# EAGLE design breakout (EAGLE 7.6.0)
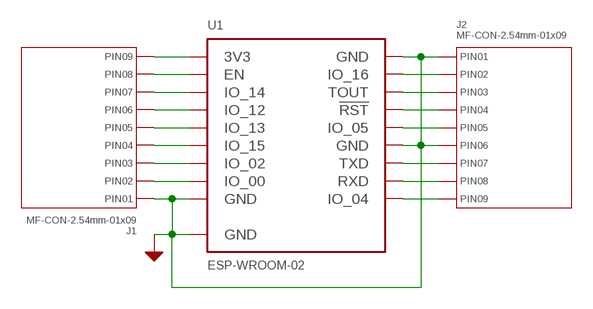
[diagram p0: schematic, sheet 1]

## Parts
J1  MF-CON-2.54mm-01x09  CON_01X09_PTH_2.54MM  [PTH_2.54MM_01X09]
J2  MF-CON-2.54mm-01x09  CON_01X09_PTH_2.54MM  [PTH_2.54MM_01X09]
U1  ESP-WROOM-02  [ESP-WROOM-02]

## Nets
GND: J1.P$1(PIN1) J2.P$1(PIN1) J2.P$6(PIN6) U1.GND U1.GND@9(GND) U1.GND@13(GND) U1.GND@18(GND)
N$1: J1.P$9(PIN9) U1.3V3
N$2: J1.P$8(PIN8) U1.EN
N$3: J1.P$7(PIN7) U1.IO_14
N$4: J1.P$6(PIN6) U1.IO_12
N$5: J1.P$5(PIN5) U1.IO_13
N$6: J1.P$4(PIN4) U1.IO_15
N$7: J1.P$3(PIN3) U1.IO_02
N$8: J1.P$2(PIN2) U1.IO_00
N$11: J2.P$2(PIN2) U1.IO_16
N$12: J2.P$3(PIN3) U1.TOUT
N$13: J2.P$4(PIN4) U1.RST(!RST)
N$14: J2.P$5(PIN5) U1.IO_05
N$16: J2.P$7(PIN7) U1.TXD
N$17: J2.P$8(PIN8) U1.RXD
N$18: J2.P$9(PIN9) U1.IO_04

## Library data of the parts
J1 J2 = MF_Connectors:CON_01X09: Library: MF_Connectors Description: Header Connector with 9 Positions and 01 Rows. Use the LABEL Attribute to label the pin on the schematic and PCB. You can remove the attributes on the PCB by using the SMASH function on the part and then deleting the text.; HOUSEPART: YES; MPN: MF-CON-2.54mm-01x09; POPULATE: 1; URL: https://factory.macrofab.com/part/MF-CON-2.54mm-01x09
U1 = Tony:ESP-WROOM-02: ESP-WROOM-02

## Board
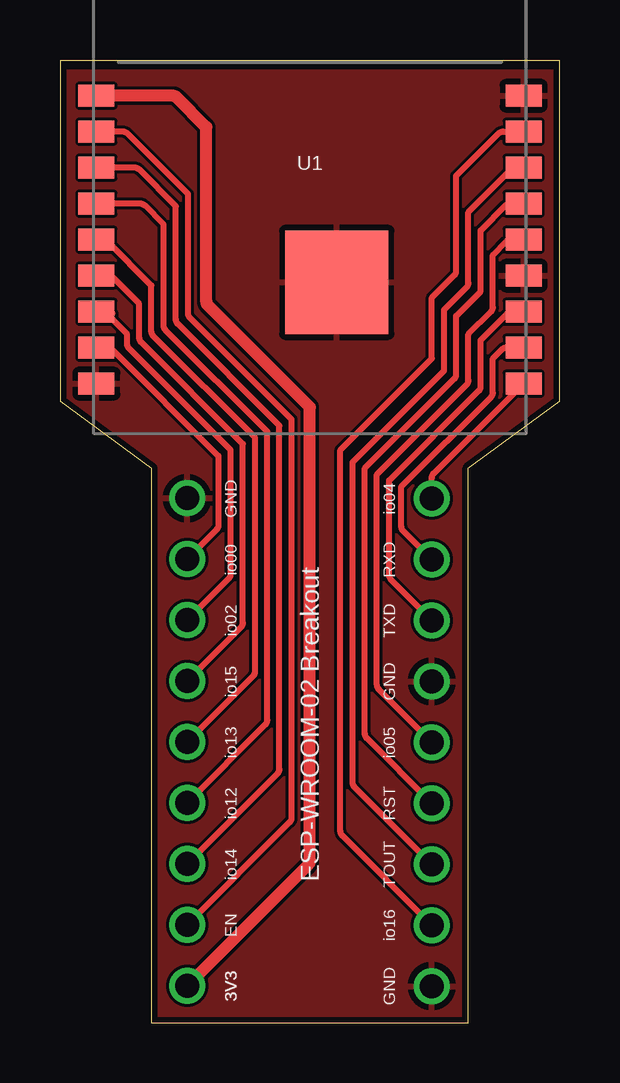
[diagram p1: board, top side]
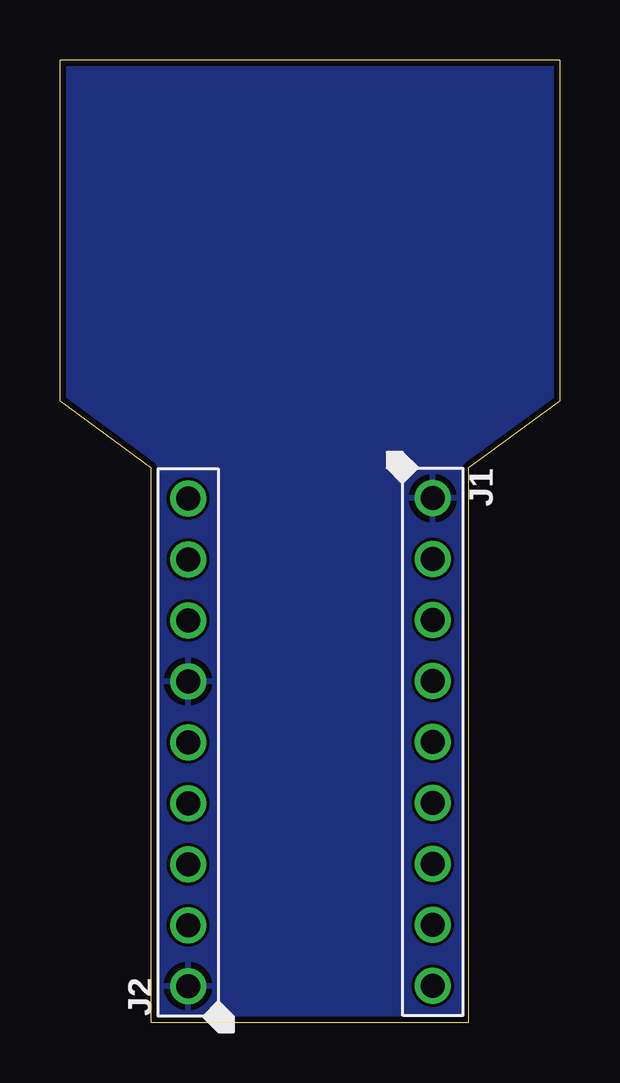
[diagram p2: board, bottom side, seen from below]

Size 20.83 x 40.13 mm. Coordinates in mm from the lower left corner, seen from the top.
Outline: 0,40.13 0,25.91 3.81,23.11 3.81,0 17.02,0 17.02,23.11 20.83,25.91 20.83,40.13 0,40.13
Copper layers (1*16): Top 0.035mm / dielectric 1.5mm / Bottom 0.035mm
Design rules "MF_4_mil_drill_2_Layer": minimum track width 5mil, minimum drill 4mil, track to track 5mil, track to pad 5mil, pad to pad 5mil, via to via 5mil, smd to smd 0mil, copper to edge 10mil, drill to drill 10mil, minimum pad ring 6mil, minimum via ring 6mil, stop-mask expansion 2mil, vias tented up to drill 25mil, thermal gap 10mil

### Footprints (pad centres in the part's own frame; a part is rotated, then mirrored left to right if it is on the bottom)
PTH_2.54MM_01X09 = drill 1: P$1 -10.16,0; P$2 -7.62,0; P$3 -5.08,0; P$4 -2.54,0; P$5 0,0; P$6 2.54,0; P$7 5.08,0; P$8 7.62,0; P$9 10.16,0
ESP-WROOM-02 = smd 1.5 x 0.9: 3V3 -8.9,4.1; EN -8.9,2.6; GND@9 -8.9,-7.9; GND@13 8.9,-3.4; GND@18 8.9,4.1; IO_00 -8.9,-6.4; IO_02 -8.9,-4.9; IO_04 8.9,-7.9; IO_05 8.9,-1.9; IO_12 -8.9,-0.4; IO_13 -8.9,-1.9; IO_14 -8.9,1.1; IO_15 -8.9,-3.4; IO_16 8.9,2.6; RST 8.9,-0.4; RXD 8.9,-6.4; TOUT 8.9,1.1; TXD 8.9,-4.9 | smd 4.3 x 4.3: GND 1.12,-3.68

### Placement (x,y rotation side)
J1  5.29,11.7 270 bottom
J2  15.49,11.68 90 bottom
U1  10.41,34.54 0 top

### Tracks (layer width: path | path; a pad name or v marks a point on that pad's centre or on a via)
GND
  pour Top (isolate 0.012): -3.59,39.66 24.3,39.66 24.56,-2.08 -3.33,-2.08
  pour Bottom (isolate 0.012): -4.35,40.43 23.54,40.43 23.8,-1.32 -4.09,-1.32
N$1
  Top 0.508: J1.P$9 10.34,6.59 arc45 10.41,6.77 10.41,25.65 6.17,29.9 arc-45 6.1,30.08 6.1,37.34 4.86,38.57 arc45 4.69,38.64 U1.3V3
N$2
  Top 0.254: J1.P$8 9.58,8.37 arc45 9.65,8.55 9.65,25.15 5.41,29.39 arc-45 5.33,29.57 5.33,34.54 2.81,37.07 arc45 2.63,37.14 U1.EN
N$3
  Top 0.254: J1.P$7 9.07,10.4 arc45 9.14,10.58 9.14,24.89 4.9,29.14 arc-45 4.83,29.31 4.83,34.04 3.29,35.57 arc45 3.11,35.64 U1.IO_14
N$4
  Top 0.254: J1.P$6 8.56,12.43 arc45 8.64,12.61 8.64,24.64 4.39,28.88 arc-45 4.32,29.06 4.32,33.27 3.52,34.07 arc45 3.34,34.14 U1.IO_12 1.82,34.14 arc-45 2,34.07
N$5
  Top 0.254: J1.P$5 8.05,14.46 arc45 8.13,14.64 8.13,24.38 3.88,28.63 arc-45 3.81,28.81 3.81,30.73 1.97,32.57 arc45 1.8,32.64 U1.IO_13
N$6
  Top 0.254: J1.P$4 7.55,16.5 arc45 7.62,16.67 7.62,24.13 3.38,28.37 arc-45 3.3,28.55 3.3,29.97 2.2,31.07 arc45 2.02,31.14 U1.IO_15
N$7
  Top 0.254: J1.P$3 7.04,18.53 arc45 7.11,18.71 7.11,23.88 2.87,28.12 arc-45 2.79,28.3 2.79,28.7 1.93,29.57 arc45 1.75,29.64 U1.IO_02 2,29.64 arc-45 2.18,29.57
N$8
  Top 0.254: U1.IO_00 1.98,28.14 arc-45 2.16,28.07 6.6,23.62 6.6,20.74 arc-45 6.53,20.56 J1.P$2
N$11
  Top 0.254: J2.P$2 11.76,7.8 arc-45 11.68,7.98 11.68,23.88 15.49,27.69 15.49,30.23 16.44,31.17 arc45 16.51,31.35 16.51,35.31 18.27,37.07 arc-45 18.45,37.14 U1.IO_16
N$12
  Top 0.254: J2.P$3 12.27,9.83 arc-45 12.19,10.01 12.19,23.37 16,27.18 16,29.72 16.94,30.66 arc45 17.02,30.84 17.02,33.78 18.81,35.57 arc-45 18.98,35.64 U1.TOUT
N$13
  Top 0.254: J2.P$4 12.77,11.86 arc-45 12.7,12.04 12.7,23.11 16.44,26.85 arc45 16.51,27.03 16.51,29.46 17.53,30.48 17.53,33.02 18.58,34.07 arc-45 18.75,34.14 U1.RST
N$14
  Top 0.254: J2.P$5 13.28,13.9 arc-45 13.21,14.08 13.21,22.86 16.94,26.6 arc45 17.02,26.77 17.02,28.7 17.96,29.64 arc45 18.03,29.82 18.03,32 18.6,32.57 arc-45 18.78,32.64 U1.IO_05
N$16
  Top 0.254: J2.P$7 13.79,18.47 arc-45 13.72,18.65 13.72,22.61 17.45,26.34 arc45 17.53,26.52 17.53,28.45 18.65,29.57 arc-45 18.83,29.64 U1.TXD
N$17
  Top 0.254: J2.P$8 14.3,20.5 arc-45 14.22,20.68 14.22,22.35 17.96,26.09 arc45 18.03,26.27 18.03,27.69 18.42,28.07 arc-45 18.6,28.14 U1.RXD
N$18
  Top 0.254: J2.P$9 15.49,22.72 arc-45 15.57,22.9 U1.IO_04

### Text on the board
tNames: GND | io04 | io00 | RXD | io02 | TXD | io15 | GND | ESP-WROOM-02 Breakout | io13 | io05 | io12 | RST | io14 | TOUT | EN | io16 | 3V3 | 3V3 | 3V3 | GND